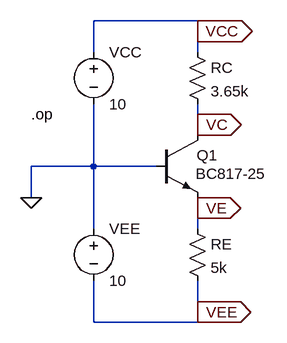
[diagram p0: schematic prob5_17_a.asc]
prob5_17_a.asc, the LTspice schematic file:
Version 4
SHEET 1 880 680
WIRE 224 -48 64 -48
WIRE 224 -32 224 -48
WIRE 64 0 64 -48
WIRE 224 0 224 -32
WIRE 224 112 224 80
WIRE 224 128 224 112
WIRE 64 176 64 80
WIRE 64 176 -32 176
WIRE 160 176 64 176
WIRE -32 224 -32 176
WIRE 224 240 224 224
WIRE 64 272 64 176
WIRE 224 272 224 240
WIRE 224 400 224 352
WIRE 64 416 64 352
WIRE 224 416 224 400
WIRE 224 416 64 416
FLAG -32 224 0
FLAG 224 112 VC
IOPIN 224 112 Out
FLAG 224 240 VE
IOPIN 224 240 Out
FLAG 224 -32 VCC
IOPIN 224 -32 Out
FLAG 224 400 VEE
IOPIN 224 400 Out
SYMBOL npn 160 128 R0
WINDOW 0 63 31 Left 2
WINDOW 3 61 59 Left 2
SYMATTR InstName Q1
SYMATTR Value BC817-25
SYMBOL voltage 64 -16 R0
SYMATTR InstName VCC
SYMATTR Value 10
SYMBOL voltage 64 256 R0
SYMATTR InstName VEE
SYMATTR Value 10
SYMBOL res 208 -16 R0
SYMATTR InstName RC
SYMATTR Value 3.65k
SYMBOL res 208 256 R0
SYMATTR InstName RE
SYMATTR Value 5k
TEXT -32 96 Left 2 !.op

The netlist it stands for:
* prob5_17_a.asc
Q1 VC 0 VE 0 BC817-25
VCC VCC 0 10
VEE 0 VEE 10
RC VCC VC 3.65k
RE VE VEE 5k
.model NPN NPN
.model PNP PNP
.lib standard.bjt
.op
.backanno
.end

* Results of the author's LTspice run, read from the files saved beside the schematic
* Operating Point:
*   V(vc) = 3.17 V
*   V(ve) = -616.2 mV
*   V(vcc) = 10 V
*   V(vee) = -10 V
*   Ic(Q1) = 1.871 mA
*   Ib(Q1) = 5.519 µA
*   Ie(Q1) = -1.877 mA
*   I(Rc) = 1.871 mA
*   I(Re) = 1.877 mA
*   I(Vcc) = -1.871 mA
*   I(Vee) = -1.877 mA